# EAGLE design RW_CAN v5 (EAGLE 9.4.2)
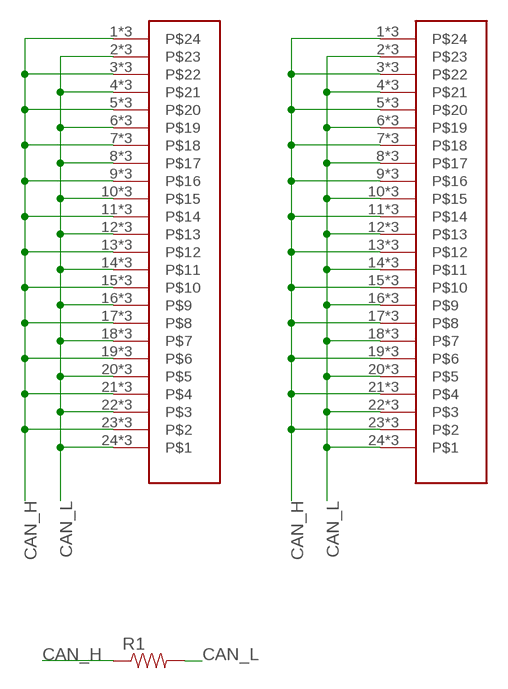
[diagram p0: schematic, sheet 1]

## Parts
R1  RESISTOR1206  [1206]
U$2  WIEDMULLERLSF-3_50-24-90  [LSF_24_90]
U$3  WIEDMULLERLSF-3_50-24-90  [LSF_24_90]

## Nets
CAN_H: R1.1 U$2.1 U$2.3 U$2.5 U$2.7 U$2.9 U$2.11 U$2.13 U$2.15 U$2.17 U$2.19 U$2.21 U$2.23 U$2.901 U$2.903 U$2.905 U$2.907 U$2.909 U$2.9011 U$2.9013 U$2.9015 U$2.9017 U$2.9019 U$2.9021 U$2.9023 U$2.9024 U$2.9026 U$2.9028 U$2.9030 U$2.9032 U$2.9034 U$2.9036 U$2.9038 U$2.9040 U$2.9042 U$2.9044 U$2.9046 U$3.1 U$3.3 U$3.5 U$3.7 U$3.9 U$3.11 U$3.13 U$3.15 U$3.17 U$3.19 U$3.21 U$3.23 U$3.901 U$3.903 U$3.905 U$3.907 U$3.909 U$3.9011 U$3.9013 U$3.9015 U$3.9017 U$3.9019 U$3.9021 U$3.9023 U$3.9024 U$3.9026 U$3.9028 U$3.9030 U$3.9032 U$3.9034 U$3.9036 U$3.9038 U$3.9040 U$3.9042 U$3.9044 U$3.9046
CAN_L: R1.2 U$2.2 U$2.4 U$2.6 U$2.8 U$2.10 U$2.12 U$2.14 U$2.16 U$2.18 U$2.20 U$2.22 U$2.24 U$2.900 U$2.902 U$2.904 U$2.906 U$2.908 U$2.9010 U$2.9012 U$2.9014 U$2.9016 U$2.9018 U$2.9020 U$2.9022 U$2.9025 U$2.9027 U$2.9029 U$2.9031 U$2.9033 U$2.9035 U$2.9037 U$2.9039 U$2.9041 U$2.9043 U$2.9045 U$2.9047 U$3.2 U$3.4 U$3.6 U$3.8 U$3.10 U$3.12 U$3.14 U$3.16 U$3.18 U$3.20 U$3.22 U$3.24 U$3.900 U$3.902 U$3.904 U$3.906 U$3.908 U$3.9010 U$3.9012 U$3.9014 U$3.9016 U$3.9018 U$3.9020 U$3.9022 U$3.9025 U$3.9027 U$3.9029 U$3.9031 U$3.9033 U$3.9035 U$3.9037 U$3.9039 U$3.9041 U$3.9043 U$3.9045 U$3.9047

## Library data of the parts
R1 = SparkFun-Passives:RESISTOR: Resistor Basic schematic elements and footprints for 0603, 1206, and PTH resistors.
U$2 U$3 = PhoenixContact:WIEDMULLERLSF-3_50-24-90

## Board
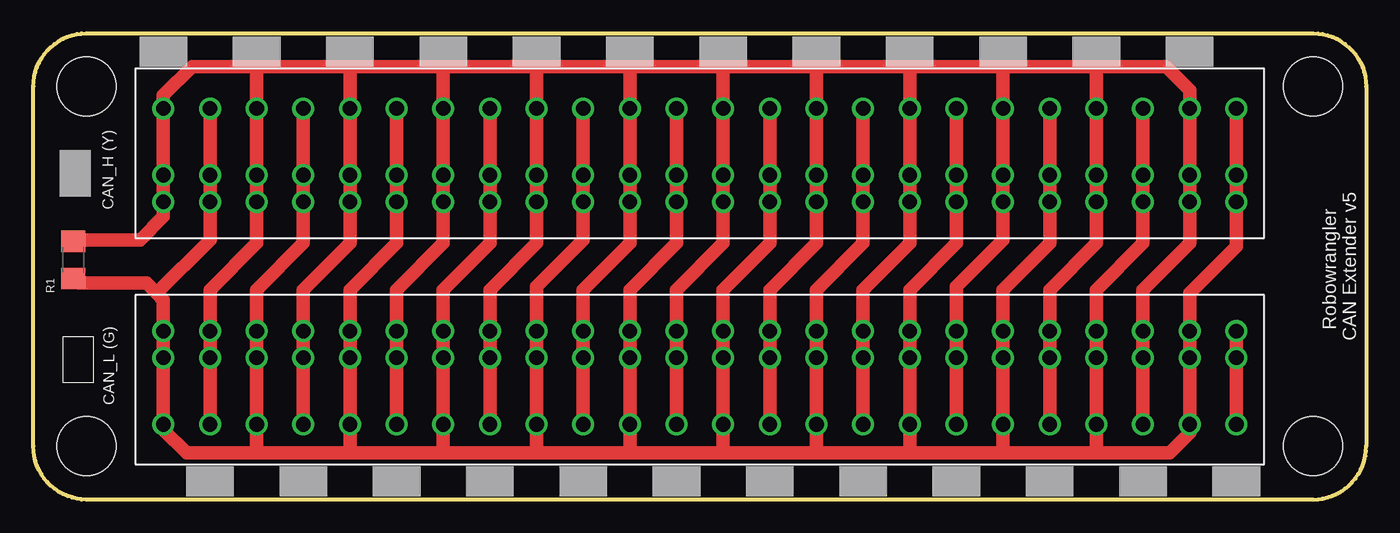
[diagram p1: board, top side]
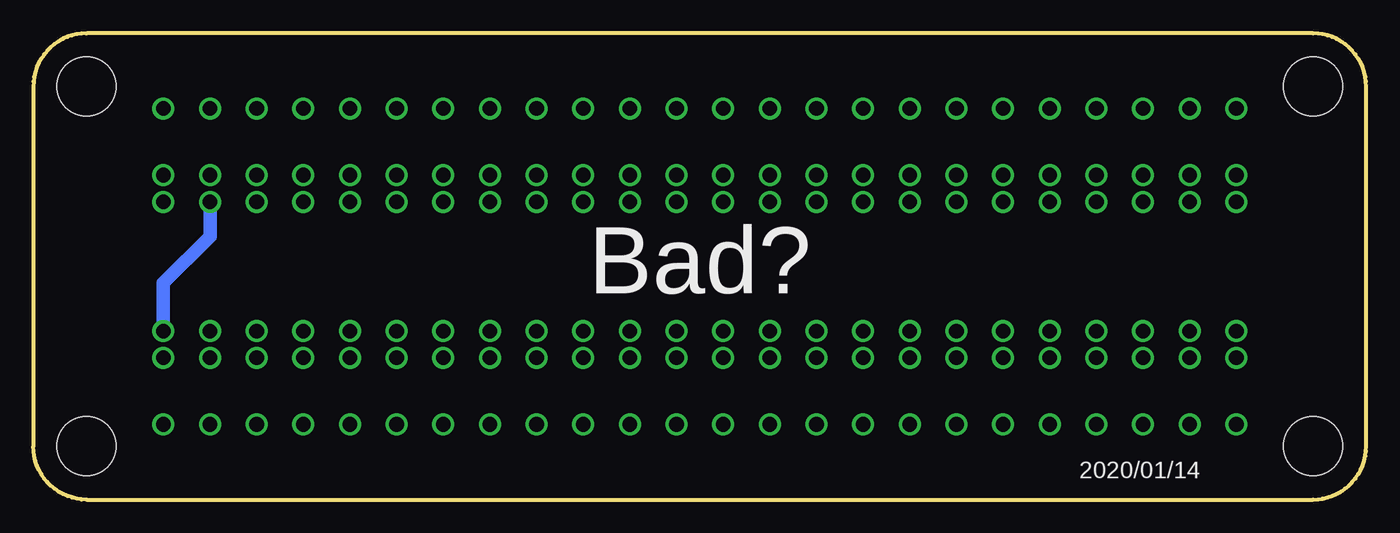
[diagram p2: board, bottom side, seen from below]

Size 100 x 35 mm. Coordinates in mm from the lower left corner, seen from the top.
Outline: 4,35 96,35 arc-90 100,31 100,4 arc-90 96,0 4,0 arc-90 0,4 0,31 arc-90 4,35
Copper layers (1*16): Top 0.035mm / dielectric 1.5mm / Bottom 0.035mm
Design rules "SeeedStudio_2layer_DRU_no_angle_20140221": minimum track width 6mil, minimum drill 12mil, track to track 6mil, track to pad 6mil, pad to pad 6mil, via to via 6mil, smd to smd 0mil, copper to edge 10mil, drill to drill 10mil, minimum pad ring 10mil, minimum via ring 6mil, stop-mask expansion 2mil, vias tented up to drill 100mil, thermal gap 10mil
Holes 4.45 mm at 4,4 96,4 4,31 96,31

### Footprints (pad centres in the part's own frame; a part is rotated, then mirrored left to right if it is on the bottom)
1206 = smd 1.6 x 1.8: 1 -1.4,0; 2 1.4,0
LSF_24_90 = drill 1.1: 1 40.25,1.65; 2 36.75,1.65; 3 33.25,1.65; 4 29.75,1.65; 5 26.25,1.65; 6 22.75,1.65; 7 19.25,1.65; 8 15.75,1.65; 9 12.25,1.65; 10 8.75,1.65; 11 5.25,1.65; 12 1.75,1.65; 13 -1.75,1.65; 14 -5.25,1.65; 15 -8.75,1.65; 16 -12.25,1.65; 17 -15.75,1.65; 18 -19.25,1.65; 19 -22.75,1.65; 20 -26.25,1.65; 21 -29.75,1.65; 22 -33.25,1.65; 23 -36.75,1.65; 24 -40.25,1.65; 900 -40.25,-3.35; 901 -36.75,-3.35; 902 -33.25,-3.35; 903 -29.75,-3.35; 904 -26.25,-3.35; 905 -22.75,-3.35; 906 -19.25,-3.35; 907 -15.75,-3.35; 908 -12.25,-3.35; 909 -8.75,-3.35; 9010 -5.25,-3.35; 9011 -1.75,-3.35; 9012 1.75,-3.35; 9013 5.25,-3.35; 9014 8.75,-3.35; 9015 12.25,-3.35; 9016 15.75,-3.35; 9017 19.25,-3.35; 9018 22.75,-3.35; 9019 26.25,-3.35; 9020 29.75,-3.35; 9021 33.25,-3.35; 9022 36.75,-3.35; 9023 40.25,-3.35; 9024 40.25,3.65; 9025 36.75,3.65; 9026 33.25,3.65; 9027 29.75,3.65; 9028 26.25,3.65; 9029 22.75,3.65; 9030 19.25,3.65; 9031 15.75,3.65; 9032 12.25,3.65; 9033 8.75,3.65; 9034 5.25,3.65; 9035 1.75,3.65; 9036 -1.75,3.65; 9037 -5.25,3.65; 9038 -8.75,3.65; 9039 -12.25,3.65; 9040 -15.75,3.65; 9041 -19.25,3.65; 9042 -22.75,3.65; 9043 -26.25,3.65; 9044 -29.75,3.65; 9045 -33.25,3.65; 9046 -36.75,3.65; 9047 -40.25,3.65

### Placement (x,y rotation side)
R1  3,18 270 top
U$2  50,26 180 top
U$3  50,9 0 top

### Tracks (layer width: path | path; a pad name or v marks a point on that pad's centre or on a via)
CAN_H
  Top 1.016: R1.1 3.1,19.5 8,19.5 9.75,21.25 U$2.9024 U$2.1 U$2.9023 9.75,30.35 11.9,32.5 16.75,32.5 | 16.75,32.5 23.75,32.5 | 23.75,32.5 30.75,32.5 | 30.75,32.5 37.75,32.5 | 37.75,32.5 44.75,32.5 | 44.75,32.5 51.75,32.5 | 51.75,32.5 58.75,32.5 | 58.75,32.5 65.75,32.5 | 65.75,32.5 72.75,32.5 | 72.75,32.5 79.75,32.5 | 79.75,32.5 85,32.5 86.75,30.75 U$2.901 U$2.23 U$2.9046 86.75,19.25 83.25,15.75 U$3.9026 U$3.3 U$3.9021 | 16.75,32.5 U$2.9021 U$2.3 U$2.9026 16.75,19.25 13.25,15.75 U$3.9046 U$3.23 U$3.901 | 23.75,32.5 U$2.9019 U$2.5 U$2.9028 23.75,19.25 20.25,15.75 U$3.9044 U$3.21 U$3.903 | 30.75,32.5 U$2.9017 U$2.7 U$2.9030 30.75,19.25 27.25,15.75 U$3.9042 U$3.19 U$3.905 | 37.75,32.5 U$2.9015 U$2.9 U$2.9032 37.75,19.25 34.25,15.75 U$3.9040 U$3.17 U$3.907 | 44.75,32.5 U$2.9013 U$2.11 U$2.9034 44.75,19.25 41.25,15.75 U$3.9038 U$3.15 U$3.909 | 51.75,32.5 U$2.9011 U$2.13 U$2.9036 51.75,19.25 48.25,15.75 U$3.9036 U$3.13 U$3.9011 | 58.75,32.5 U$2.909 U$2.15 U$2.9038 58.75,19.25 55.25,15.75 U$3.9034 U$3.11 U$3.9013 | 65.75,32.5 U$2.907 U$2.17 U$2.9040 65.75,19.25 62.25,15.75 U$3.9032 U$3.9 U$3.9015 | 72.75,32.5 U$2.905 U$2.19 U$2.9042 72.75,19.5 69.25,16 U$3.9030 U$3.7 U$3.9017 | 79.75,32.5 U$2.903 U$2.21 U$2.9044 79.75,19.25 76.25,15.75 U$3.9028 U$3.5 U$3.9019 | U$3.9023 U$3.1 U$3.9024
  Bottom 1.016: U$2.9046 86.75,19.75 90.25,16.25 U$3.9024
CAN_L
  Top 1.016: R1.2 3.35,16.25 8.5,16.25 9.25,15.5 | 9.25,15.5 9.75,15 U$3.9047 U$3.24 U$3.900 9.75,5.25 11.5,3.5 16.75,3.5 | 16.75,3.5 23.75,3.5 | 23.75,3.5 30.75,3.5 | 30.75,3.5 37.75,3.5 | 37.75,3.5 44.75,3.5 | 44.75,3.5 51.75,3.5 | 51.75,3.5 58.75,3.5 | 58.75,3.5 65.5,3.5 | 65.5,3.5 72.75,3.5 | 72.75,3.5 79.75,3.5 | 79.75,3.5 85.25,3.5 86.75,5 U$3.9022 U$3.2 U$3.9025 86.75,15.5 90.25,19 U$2.9047 U$2.24 U$2.900 | 16.75,3.5 U$3.902 U$3.22 U$3.9045 16.75,15.75 20.25,19.25 U$2.9027 U$2.4 U$2.9020 | 23.75,3.5 U$3.904 U$3.20 U$3.9043 23.75,15.75 27.25,19.25 U$2.9029 U$2.6 U$2.9018 | 30.75,3.5 U$3.906 U$3.18 U$3.9041 30.75,15.75 34.25,19.25 U$2.9031 U$2.8 U$2.9016 | 37.75,3.5 U$3.908 U$3.16 U$3.9039 37.75,16 41.25,19.5 U$2.9033 U$2.10 U$2.9014 | 44.75,3.5 U$3.9010 U$3.14 U$3.9037 44.75,15.75 48.25,19.25 U$2.9035 U$2.12 U$2.9012 | 51.75,3.5 U$3.9012 U$3.12 U$3.9035 51.75,15.75 55.25,19.25 U$2.9037 U$2.14 U$2.9010 | 58.75,3.5 U$3.9014 U$3.10 U$3.9033 58.75,15.75 62.25,19.25 U$2.9039 U$2.16 U$2.908 | 65.5,3.5 65.75,3.75 U$3.9016 U$3.8 U$3.9031 65.75,15.75 69.25,19.25 U$2.9041 U$2.18 U$2.906 | 72.75,3.5 U$3.9018 U$3.6 U$3.9029 72.75,15.75 76.25,19.25 U$2.9043 U$2.20 U$2.904 | 79.75,3.5 U$3.9020 U$3.4 U$3.9027 79.75,15.75 83.25,19.25 U$2.9045 U$2.22 U$2.902 | U$2.9022 U$2.2 U$2.9025 13.25,19.5 9.25,15.5

### Text on the board
tNames: CAN_H (Y) | Robowrangler / CAN Extender v5 | R1 | CAN_L (G)
bNames: Bad? | 2020/01/14